# Altium schematic sheet Schematic_Muon.schdoc
size 1096 x 268 mm
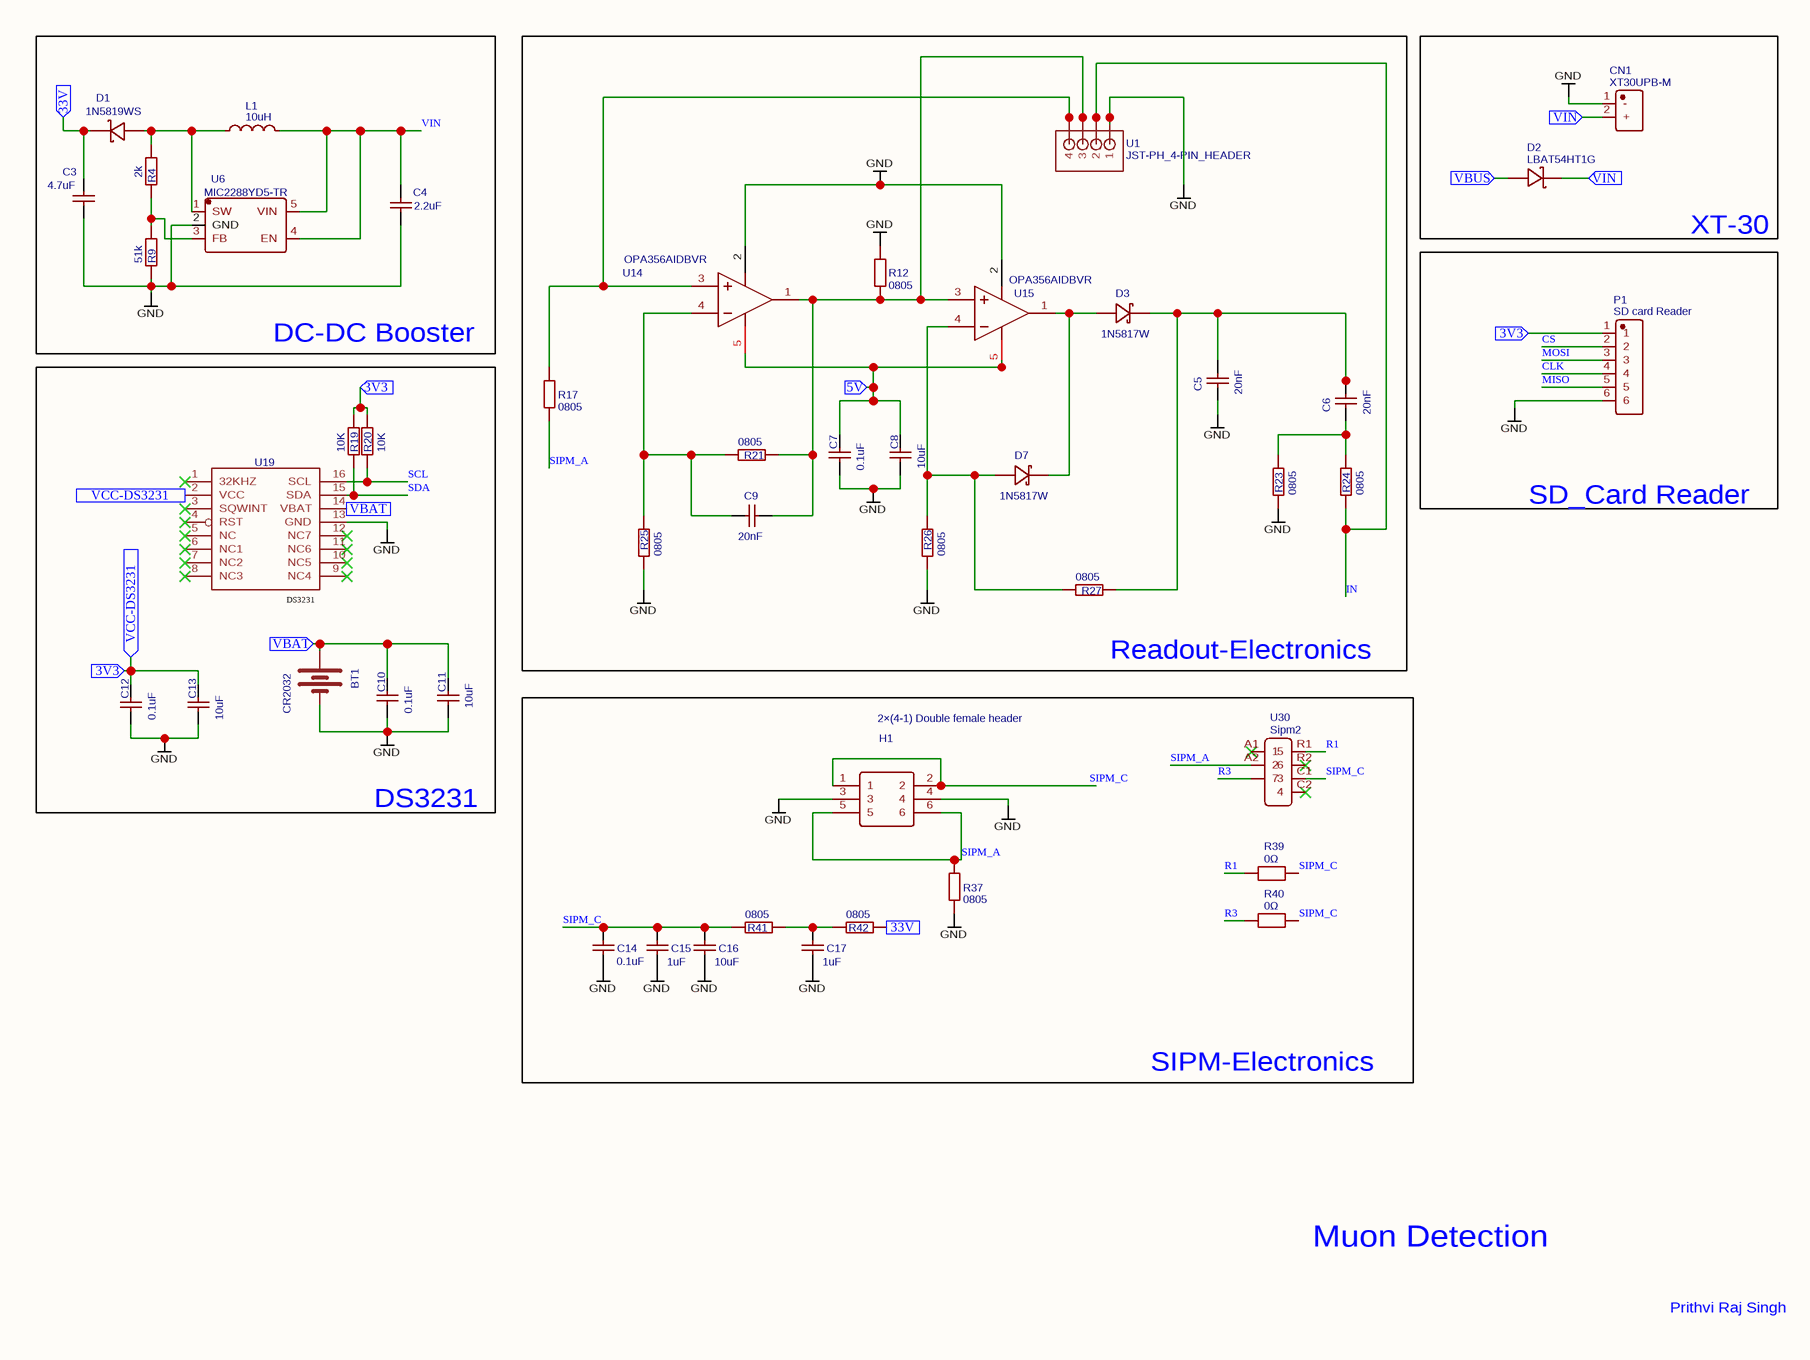
[diagram p0: Schematic_Muon.schdoc, column 1 of 4]
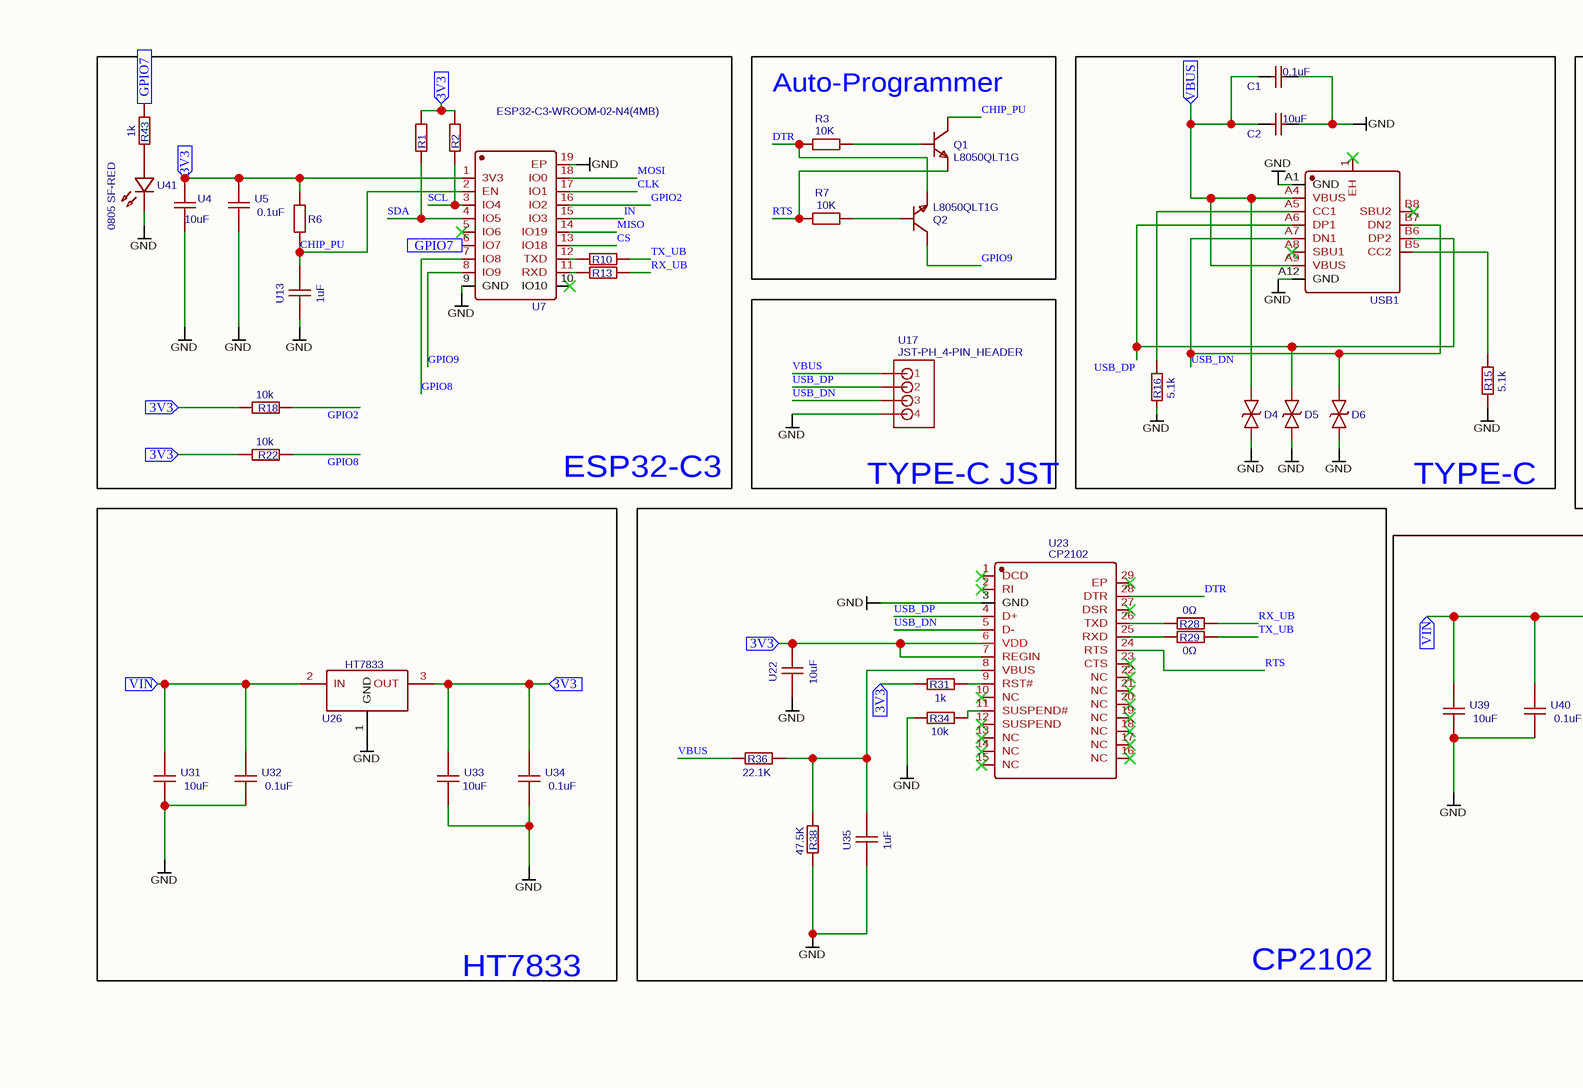
[diagram p1: Schematic_Muon.schdoc, column 2 of 4]
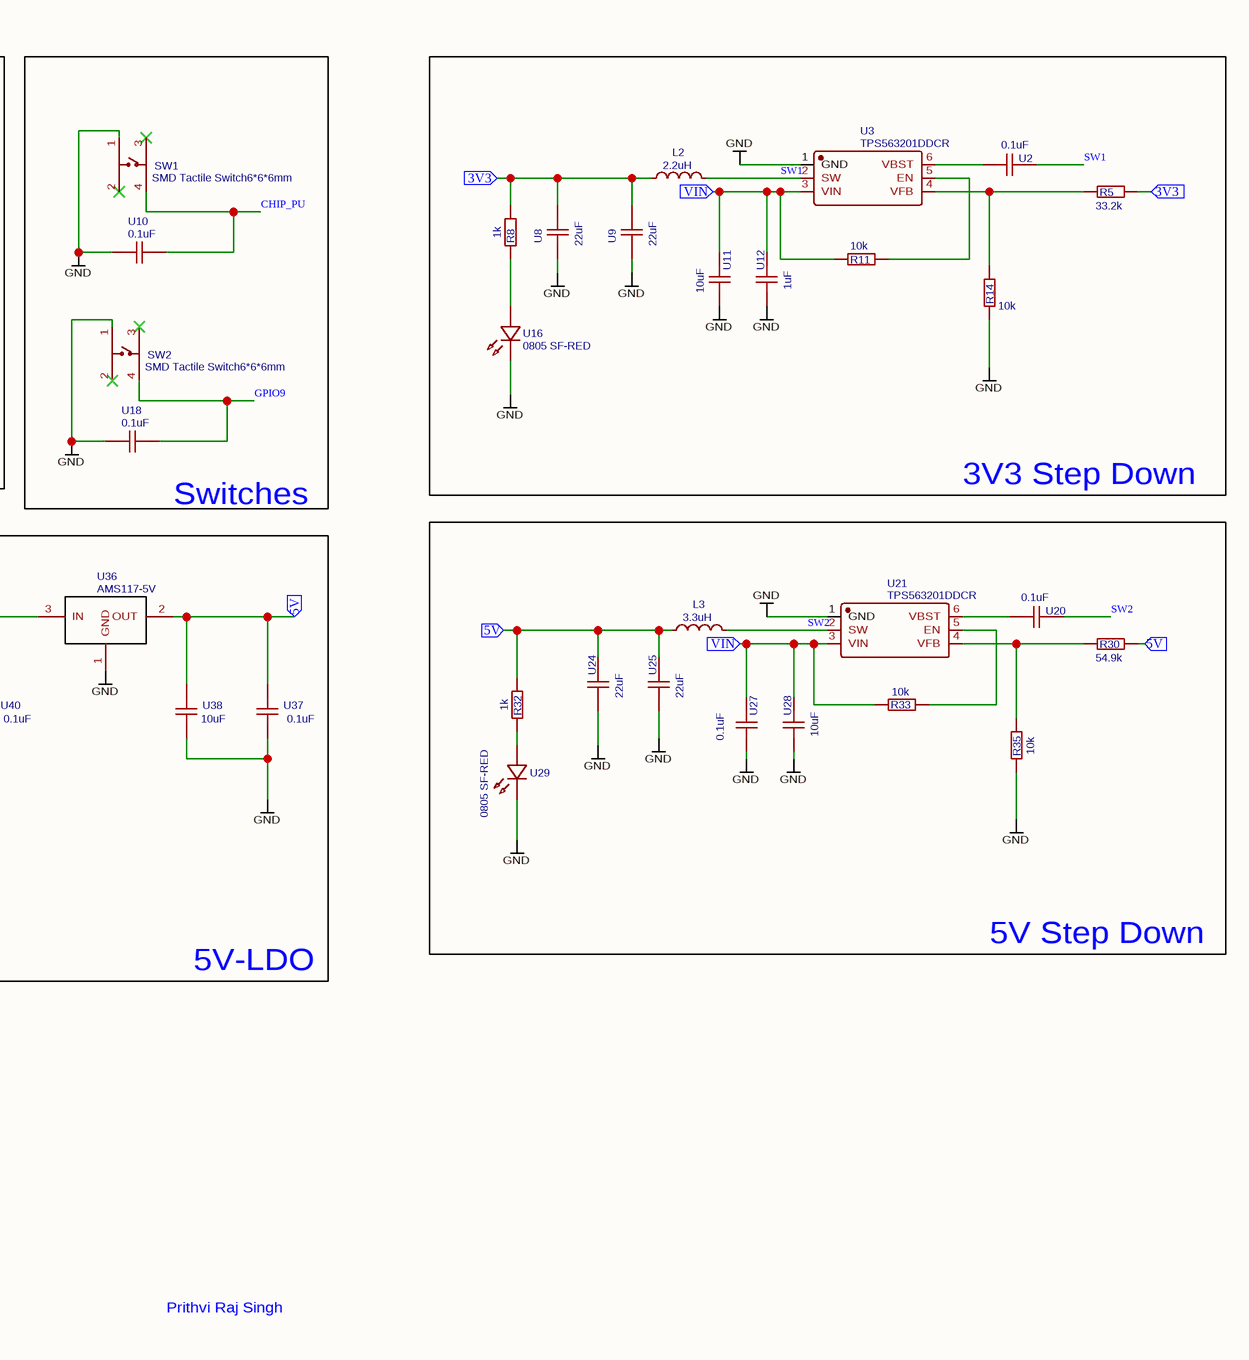
[diagram p2: Schematic_Muon.schdoc, column 3 of 4]
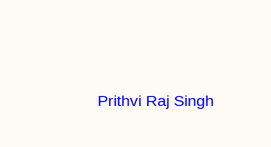
[diagram p3: Schematic_Muon.schdoc, column 4 of 4]

## Parts
BT1  CR2032  [BAT-SMD_CR2032]
C1  0.1uF  [C0805]
C2  10uF  [C0805]
C3  4.7uF  [C0805]
C4  2.2uF  [C0805]
C5  20nF  [C0805]
C6  20nF  [C0805]
C7  0.1uF  [C0805]
C8  10uF  [C0805]
C9  20nF  [C0805]
C10  0.1uF  [C0805]
C11  10uF  [C0805]
C12  0.1uF  [C0805]
C13  10uF  [C0805]
C14  0.1uF  [C0805]
C15  1uF  [C0805]
C16  10uF  [C0805]
C17  1uF  [C0805]
CN1  XT30UPB-M  [CONN-TH_XT30UPB-M]
D1  1N5819WS  [SOD-323_L1.8-W1.3-LS2.5-RD]
D2  LBAT54HT1G  [SOD-323_L1.8-W1.3-LS2.5-RD]
D3  1N5817W  [SOD-123_L2.8-W1.8-LS3.7-RD]
D4  SMBJ7.5CA-QH  [DO-214AA_L4.4-W3.6-LS5.3-BI]  (value not drawn)
D5  SMBJ7.5CA-QH  [DO-214AA_L4.4-W3.6-LS5.3-BI]  (value not drawn)
D6  SMBJ7.5CA-QH  [DO-214AA_L4.4-W3.6-LS5.3-BI]  (value not drawn)
D7  1N5817W  [SOD-123_L2.8-W1.8-LS3.7-RD]
H1  2×(4-1) Double female header  [HDR-TH_6P-P2.54-V-F-R2-C3-S2.54-1]
L1  10uH  [IND-SMD_L6.0-W6.0_FNR60XXS]
L2  2.2uH  [IND-SMD_L4.0-W4.0_SMNR4012]
L3  3.3uH  [IND-SMD_L4.0-W4.0_SMNR4012]
P1  SD card Reader  [HDR-TH_6P-P2.54-V-F]
Q1  L8050QLT1G  [SOT-23-3_L2.9-W1.3-P1.90-LS2.4-BR]
Q2  L8050QLT1G  [SOT-23-3_L2.9-W1.3-P1.90-LS2.4-BR]
R1  10k  [R0805]  (value not drawn)
R2  10k  [R0805]  (value not drawn)
R3  10K  [R0805]
R4  2k  [R0805]
R5  33.2k  [R0805]
R6  10K  [R0805]  (value not drawn)
R7  10K  [R0805]
R8  1k  [R0805]
R9  51k  [R0805]
R10  499  [R0805]  (value not drawn)
R11  10k  [R0805]
R12  0805  [R0805]
R13  499  [R0805]  (value not drawn)
R14  10k  [R0805]
R15  5.1k  [R0805]
R16  5.1k  [R0805]
R17  0805  [R0805]
R18  10k  [R0805]
R19  10K  [R0805]
R20  10K  [R0805]
R21  0805  [R0805]
R22  10k  [R0805]
R23  0805  [R0805]
R24  0805  [R0805]
R25  0805  [R0805]
R26  0805  [R0805]
R27  0805  [R0805]
R28  0Ω  [R0805]
R29  0Ω  [R0805]
R30  54.9k  [R0805]
R31  1k  [R0805]
R32  1k  [R0805]
R33  10k  [R0805]
R34  10k  [R0805]
R35  10k  [R0805]
R36  22.1K  [R0805]
R37  0805  [R0805]
R38  47.5K  [R0805]
R39  0Ω  [R0805]
R40  0Ω  [R0805]
R41  0805  [R0805]
R42  0805  [R0805]
R43  1k  [R0805]
SW1  SMD Tactile Switch6*6*6mm  [SW-SMD_4P-L6.0-W6.0-P4.50-LS9.0_C23873]
SW2  SMD Tactile Switch6*6*6mm  [SW-SMD_4P-L6.0-W6.0-P4.50-LS9.0_C23873]
U1  JST-PH_4-PIN_HEADER  [JST_B4B-PH_HEADER]
U2  0.1uF  [C0402]
U3  TPS563201DDCR  [SOT-23-6_L2.9-W1.6-P0.95-LS2.8-BR]
U4  10uF  [C0402]
U5  0.1uF  [C0402]
U6  MIC2288YD5-TR  [TSOT-23-5_L2.9-W1.6-P0.95-LS2.8-BR]
U7  ESP32-C3-WROOM-02-N4(4MB)  [BULETM-SMD_ESPRESSIF_ESP32-C3-WROOM-02-N4-4MB]
U8  22uF  [C0402]
U9  22uF  [C0402]
U10  0.1uF  [C0402]
U11  10uF  [C0402]
U12  1uF  [C0402]
U13  1uF  [C0402]
U14  OPA356AIDBVR  [SOT-23-5_L3.0-W1.7-P0.95-LS2.8-BR]
U15  OPA356AIDBVR  [SOT-23-5_L3.0-W1.7-P0.95-LS2.8-BR]
U16  0805 SF-RED  [LED0805-RD_RED]
U17  JST-PH_4-PIN_HEADER  [JST_B4B-PH_HEADER]
U18  0.1uF  [C0402]
U19  DS3231  [SO16W]  (value not drawn)
U20  0.1uF  [C0402]
U21  TPS563201DDCR  [SOT-23-6_L2.9-W1.6-P0.95-LS2.8-BR]
U22  10uF  [C0402]
U23  CP2102  [QFN-28_L5.0-W5.0-P0.50-TL-EP3.2]
U24  22uF  [C0402]
U25  22uF  [C0402]
U26  HT7833  [SOT-89_L4.5-W2.5-P1.50-LS4.2-BR]
U27  0.1uF  [C0402]
U28  10uF  [C0402]
U29  0805 SF-RED  [LED0805-RD_RED]
U30  Sipm2  [SIPM_REVERSE]
U31  10uF  [C0402]
U32  0.1uF  [C0402]
U33  10uF  [C0402]
U34  0.1uF  [C0402]
U35  1uF  [C0402]
U36  AMS117-5V  [AMS117-TOPL]
U37  0.1uF  [C0402]
U38  10uF  [C0402]
U39  10uF  [C0402]
U40  0.1uF  [C0402]
U41  0805 SF-RED  [LED0805-RD_RED]
USB1  HX TYPE-C 16P 3MD 5A  [TYPE-C-SMD_HX-TYPE-C-16P-3MD-5A]  (value not drawn)

## Blocks framed on the sheet
DC-DC Booster: C3 C4 D1 L1 R4 R9 U6
Readout-Electronics: C5-C9 D3 D7 R12 R17 R21 R23-R27 U1 U14 U15
XT-30: CN1 D2
ESP32-C3: R1 R2 R6 R10 R13 R18 R22 R43 U4 U5 U7 U13 U41
Auto-Programmer: Q1 Q2 R3 R7
3V3 Step Down: L2 R5 R8 R11 R14 U2 U3 U8 U9 U11 U12 U16
SD_Card Reader: P1
DS3231: BT1 C10-C13 R19 R20 U19
5V-LDO: U36-U40
5V Step Down: L3 R30 R32 R33 R35 U20 U21 U24 U25 U27-U29
SIPM-Electronics: C14-C17 H1 R37 R39-R42 U30

## Ports
3V3 (in), 5V (in), 33V (in), GPIO7 (in), VBAT (in), VBUS (in), VCC-DS3231 (in), VIN (in)

## Nets
GND: BT1.1(-) C1.2 C2.2 C3.2 C4.2 C5.2 C7.2 C8.2 C10.2 C11.2 C12.2 C13.2 C14.2 C15.2 C16.2 C17.2 CN1.1(-) D4.2 D5.2 D6.2 H1.3 H1.4 P1.6 R9.1 R12.2 R14.1 R15.2 R16.1 R23.1 R25.2 R26.2 R34.1 R35.1 R37.1 R38.2 SW1.1 SW2.1 U1.P1(1) U3.1(GND) U4.2 U5.2 U6.2(GND) U7.9(GND) U7.19(EP) U8.2 U9.2 U10.1 U11.2 U12.2 U13.2 U14.2(V-) U15.2(V-) U16.1(K) U17.P4(4) U18.1 U19.13(GND) U21.1(GND) U22.2 U23.3(GND) U24.2 U25.2 U26.1(GND) U27.2 U28.2 U29.1(K) U31.2 U32.2 U33.2 U34.2 U35.2 U36.1(GND) U37.2 U38.2 U39.2 U40.2 U41.1(K) USB1.A1(GND) USB1.A12(GND)
3V3: C12.1 C13.1 L2.1 P1.1 R1.2 R2.2 R5.1 R6.1 R8.2 R18.1 R19.1 R20.1 R22.1 R31.1 U4.1 U5.1 U7.1(3V3) U8.1 U9.1 U19.2(VCC) U22.1 U23.6(VDD) U23.7(REGIN) U26.3(OUT) U33.1 U34.1 ; port 3V3, port VCC-DS3231
5V: C7.1 C8.1 L3.1 R30.1 R32.2 U14.5(V+) U15.5(V+) U24.1 U25.1 U36.2(OUT) U37.1 U38.1 ; port 5V
33V: C3.1 D1.1(K) R42.2 ; port 33V
CHIP_PU: Q1.3(C) R6.2 SW1.4 U7.2(EN) U10.2 U13.1
CLK: P1.4 U7.17(IO1)
CS: P1.2 U7.13(IO18)
DTR: Q2.2(E) R3.1 U23.28(DTR)
GPIO2: R18.2 U7.16(IO2)
GPIO7: R43.2 U7.6(IO7) ; port GPIO7
GPIO8: R22.2 U7.7(IO8)
GPIO9: Q2.3(C) SW2.4 U7.8(IO9) U18.2
IN: R24.1 U1.P2(2) U7.15(IO3)
MISO: P1.5 U7.14(IO19)
MOSI: P1.3 U7.18(IO0)
R1: R39.1 U30.R1(5)
R3: R40.1 U30.?1(7)
RTS: Q1.2(E) R7.1 U23.24(RTS)
RX_UB: R13.2 R28.2
SCL: R2.1 R20.2 U7.3(IO4) U19.16(SCL)
SDA: R1.1 R19.2 U7.4(IO5) U19.15(SDA)
SIPM_A: H1.5 H1.6 R17.1 R37.2 U30.A2(2)
SIPM_C: C14.1 C15.1 C16.1 H1.1 H1.2 R39.2 R40.2 R41.1 U30.C1(3)
SW1: L2.2 U2.2 U3.2(SW)
SW2: L3.2 U20.2 U21.2(SW)
TX_UB: R10.2 R29.2
USB_DN: D6.1 U17.P3(3) U23.5(D-) USB1.A7(DN1) USB1.B7(DN2)
USB_DP: D5.1 U17.P2(2) U23.4(D+) USB1.A6(DP1) USB1.B6(DP2)
VBAT: BT1.2(+) C10.1 C11.1 U19.14(VBAT) ; port VBAT
VBUS: R36.1 U17.P1(1)
VBUS: C1.1 C2.1 D2.2(A) D4.1 USB1.A4(VBUS) USB1.A9(VBUS) ; port VBUS  [a separate net that carries the same name]
VIN: CN1.2(+) D2.1(K) R11.2 R33.2 U3.3(VIN) U11.1 U12.1 U21.3(VIN) U26.2(IN) U27.1 U28.1 U31.1 U32.1 U36.3(IN) U39.1 U40.1 ; port VIN
VIN: C4.1 L1.2 U6.4(EN) U6.5(VIN)  [a separate net that carries the same name]
NetC5_1: C5.1 C6.1 D3.1(C) R27.1
NetC6_2: C6.2 R23.2 R24.2
NetC9_1: C9.1 R21.1 R25.1 U14.4(IN-)
NetC9_2: C9.2 R12.1 R21.2 U1.P3(3) U14.1(OUT) U15.3(IN+)
NetC17_1: C17.1 R41.2 R42.1
NetD1_2: D1.2(A) L1.1 R4.2 U6.1(SW)
NetD3_2: D3.2(A) D7.1(C) U15.1(OUT)
NetD7_2: D7.2(A) R26.1 R27.2 U15.4(IN-)
NetQ1_1: Q1.1(B) R3.2
NetQ2_1: Q2.1(B) R7.2
NetR4_1: R4.1 R9.2 U6.3(FB)
NetR5_2: R5.2 R14.2 U3.4(VFB)
NetR8_1: R8.1 U16.2(A)
NetR10_1: R10.1 U7.12(TXD)
NetR11_1: R11.1 U3.5(EN)
NetR13_1: R13.1 U7.11(RXD)
NetR15_1: R15.1 USB1.B5(CC2)
NetR16_2: R16.2 USB1.A5(CC1)
NetR17_2: R17.2 U1.P4(4) U14.3(IN+)
NetR28_1: R28.1 U23.26(TXD)
NetR29_1: R29.1 U23.25(RXD)
NetR30_2: R30.2 R35.2 U21.4(VFB)
NetR31_2: R31.2 U23.9(RST#)
NetR32_1: R32.1 U29.2(A)
NetR33_1: R33.1 U21.5(EN)
NetR34_2: R34.2 U23.11(SUSPEND#)
NetR36_2: R36.2 R38.1 U23.8(VBUS) U35.1
NetR43_1: R43.1 U41.2(A)
NetU2_1: U2.1 U3.6(VBST)
NetU20_1: U20.1 U21.6(VBST)

Not connected (* = marked no-connect by the designer): SW1 2* 3*; SW2 2* 3*; U7 5(IO6)* 10(IO10)*; U19 1(32KHZ)* 3(SQWINT)* 4(RST)* 5(NC)* 6(NC1)* 7(NC2)* 8(NC3)* 9(NC4)* 10(NC5)* 11(NC6)* 12(NC7)*; U23 1(DCD)* 2(RI)* 10(NC)* 12(SUSPEND)* 13(NC)* 14(NC)* 15(NC)* 16(NC)* 17(NC)* 18(NC)* 19(NC)* 20(NC)* 21(NC)* 22(NC)* 23(CTS)* 27(DSR)* 29(EP)*; U30 A1(1)* C2(4)* R2(6)*; USB1 1(EH)* A8(SBU1)* B8(SBU2)*

## Notes on the sheet
- (near U17) TYPE-C JST
- TYPE-C
- (near U18) Switches
- HT7833
- CP2102
- Muon Detection
- Prithvi Raj Singh

## Library data of the parts
BT1 = CR2032: Manufacturer: null; Contributor: LCSC; Supplier: LCSC; Supplier Part: C9900001893; Manufacturer Part: CR2032; JLCPCB Part Class: Extended Part; spicePre: B; spiceSymbolName: CR2032_C9900001893
C1 C7 C10 C12 C14 = 0.1uF: Manufacturer: FH(风华); Manufacturer Part: 0805B203K500NT; nameAlias: Value; Supplier: LCSC; Supplier Part: C1726; JLCPCB Part Class: Extended Part; spicePre: C; spiceSymbolName: 0805B203K500NT
C2 C8 C11 C13 C16 = 10uF: Manufacturer: FH(风华); Manufacturer Part: 0805B203K500NT; nameAlias: Value; Supplier: LCSC; Supplier Part: C1726; JLCPCB Part Class: Extended Part; spicePre: C; spiceSymbolName: 0805B203K500NT
C3 = 4.7uF: Manufacturer: FH(风华); Manufacturer Part: 0805B203K500NT; nameAlias: Value; Supplier: LCSC; Supplier Part: C1726; JLCPCB Part Class: Extended Part; spicePre: C; spiceSymbolName: 0805B203K500NT
C4 = 2.2uF: Manufacturer: FH(风华); Manufacturer Part: 0805B203K500NT; nameAlias: Value; Supplier: LCSC; Supplier Part: C1726; JLCPCB Part Class: Extended Part; spicePre: C; spiceSymbolName: 0805B203K500NT
C5 C6 C9 = 20nF: Manufacturer: FH(风华); Manufacturer Part: 0805B203K500NT; nameAlias: Value; Supplier: LCSC; Supplier Part: C1726; JLCPCB Part Class: Extended Part; spicePre: C; spiceSymbolName: 0805B203K500NT
C15 C17 = 1uF: Manufacturer: FH(风华); Manufacturer Part: 0805B203K500NT; nameAlias: Value; Supplier: LCSC; Supplier Part: C1726; JLCPCB Part Class: Extended Part; spicePre: C; spiceSymbolName: 0805B203K500NT
CN1 = XT30UPB-M: Manufacturer: AMASS(艾迈斯); Contributor: LCSC; Supplier: LCSC; Supplier Part: C428721; Manufacturer Part: XT30UPB-M; JLCPCB Part Class: Extended Part; spicePre: C; spiceSymbolName: XT30UPB-M
D1 = 1N5819WS: Manufacturer: Hottech(合科泰); Contributor: LCSC; Supplier: LCSC; Supplier Part: C191023; Manufacturer Part: 1N5819WS; JLCPCB Part Class: Basic Part; spicePre: D; spiceSymbolName: 1N5819WS
D2 = LBAT54HT1G: Manufacturer: LRC(乐山无线电); Supplier: LCSC; Manufacturer Part: LBAT54HT1G; Supplier Part: C12744; JLCPCB Part Class: Extended Part; spicePre: D; spiceSymbolName: LBAT54HT1G
D3 D7 = 1N5817W: Manufacturer: TWGMC(台湾迪嘉); Contributor: LCSC; Supplier: LCSC; Supplier Part: C727113; Manufacturer Part: 1N5817W; JLCPCB Part Class: Extended Part; spicePre: D; spiceSymbolName: 1N5817W
D4-D6 = SMBJ7.5CA-QH: Manufacturer: BOURNS; Contributor: lcsc; Supplier: LCSC; Supplier Part: C1518389; Manufacturer Part: SMBJ7.5CA-QH; JLCPCB Part Class: Extended Part; spicePre: D; spiceSymbolName: SMBJ7.5CA-QH
H1 = 2×(4-1) Double female header: Manufacturer: BOOMELE; Supplier: LCSC; Manufacturer Part: 2×(4-1) Double female header; Supplier Part: C60376; JLCPCB Part Class: Extended Part; spicePre: H; spiceSymbolName: 2×(4-1) Double female header
L1 = 10uH: Manufacturer: Sunlord(顺络); Manufacturer Part: SWPA6028S100MT; nameAlias: Value; Supplier: LCSC; Supplier Part: C65664; JLCPCB Part Class: Extended Part; spicePre: L; spiceSymbolName: SWPA6028S100MT
L2 = 2.2uH: Manufacturer: Sunlord(顺络); Manufacturer Part: SWPA4030S3R3MT; nameAlias: Value; Supplier: LCSC; Supplier Part: C15269; JLCPCB Part Class: Extended Part; spicePre: L; spiceSymbolName: SWPA4030S3R3MT
L3 = 3.3uH: Manufacturer: Sunlord(顺络); Manufacturer Part: SWPA4030S3R3MT; nameAlias: Value; Supplier: LCSC; Supplier Part: C15269; JLCPCB Part Class: Extended Part; spicePre: L; spiceSymbolName: SWPA4030S3R3MT
P1 = SD card Reader: Manufacturer: BOOMELE(博穆精密); Manufacturer Part: 2.54-1*6P母; Supplier: LCSC; Supplier Part: C40877; JLCPCB Part Class: Extended Part; spicePre: P; spiceSymbolName: Header-Female-2.54_1x6
Q1 Q2 = L8050QLT1G: Manufacturer: LRC(乐山无线电); Supplier: LCSC; Manufacturer Part: L8050QLT1G; Supplier Part: C49581; JLCPCB Part Class: Extended Part; spicePre: Q; spiceSymbolName: L8050QLT1G
R1 R2 R11 R14 R18 R22 R33-R35 = 10k: Manufacturer: null; Manufacturer Part: 0805; Contributor: LCSC; Supplier: LCSC; Supplier Part: C9900012714; JLCPCB Part Class: Extended Part; spicePre: R; spiceSymbolName: 0805_C9900012714
R3 R6 R7 R19 R20 = 10K: Manufacturer: null; Manufacturer Part: 0805; Contributor: LCSC; Supplier: LCSC; JLCPCB Part Class: Extended Part; spicePre: R
  R3 R6 R7: Supplier Part: C9900012714; spiceSymbolName: 0805_C9900012714
  R19 R20: Supplier Part: C9900012715; spiceSymbolName: 0805
R4 = 2k: Manufacturer: null; Manufacturer Part: 0805; Contributor: LCSC; Supplier: LCSC; Supplier Part: C9900012715; JLCPCB Part Class: Extended Part; spicePre: R; spiceSymbolName: 0805
R5 = 33.2k: Manufacturer: null; Manufacturer Part: 0805; Contributor: LCSC; Supplier: LCSC; Supplier Part: C9900012714; JLCPCB Part Class: Extended Part; spicePre: R; spiceSymbolName: 0805_C9900012714
R8 R31 R32 R43 = 1k: Manufacturer: null; Manufacturer Part: 0805; Contributor: LCSC; Supplier: LCSC; Supplier Part: C9900012714; JLCPCB Part Class: Extended Part; spicePre: R; spiceSymbolName: 0805_C9900012714
R9 = 51k: Manufacturer: null; Manufacturer Part: 0805; Contributor: LCSC; Supplier: LCSC; Supplier Part: C9900012715; JLCPCB Part Class: Extended Part; spicePre: R; spiceSymbolName: 0805
R10 R13 = 499: Manufacturer: null; Manufacturer Part: 0805; Contributor: LCSC; Supplier: LCSC; Supplier Part: C9900012714; JLCPCB Part Class: Extended Part; spicePre: R; spiceSymbolName: 0805_C9900012714
R12 R17 R21 R23-R27 R37 R41 R42 = 0805: Manufacturer: null; Contributor: LCSC; Supplier: LCSC; Supplier Part: C9900012715; Manufacturer Part: 0805; JLCPCB Part Class: Extended Part; spicePre: R; spiceSymbolName: 0805
R15 R16 = 5.1k: Manufacturer: null; Manufacturer Part: 0805; Contributor: LCSC; Supplier: LCSC; Supplier Part: C9900012714; JLCPCB Part Class: Extended Part; spicePre: R; spiceSymbolName: 0805_C9900012714
R28 R29 = 0Ω: Manufacturer: null; Manufacturer Part: 0805; Contributor: LCSC; Supplier: LCSC; Supplier Part: C9900012714; JLCPCB Part Class: Extended Part; spicePre: R; spiceSymbolName: 0805_C9900012714
R30 = 54.9k: Manufacturer: null; Manufacturer Part: 0805; Contributor: LCSC; Supplier: LCSC; Supplier Part: C9900012714; JLCPCB Part Class: Extended Part; spicePre: R; spiceSymbolName: 0805_C9900012714
R36 = 22.1K: Manufacturer: null; Manufacturer Part: 0805; Contributor: LCSC; Supplier: LCSC; Supplier Part: C9900012714; JLCPCB Part Class: Extended Part; spicePre: R; spiceSymbolName: 0805_C9900012714
R38 = 47.5K: Manufacturer: null; Manufacturer Part: 0805; Contributor: LCSC; Supplier: LCSC; Supplier Part: C9900012714; JLCPCB Part Class: Extended Part; spicePre: R; spiceSymbolName: 0805_C9900012714
R39 R40 = 0Ω: Manufacturer: FOJAN(富捷); Manufacturer Part: FRC0805P000 TS; Contributor: lcsc; nameAlias: Value; Supplier: LCSC; Supplier Part: C2907288; JLCPCB Part Class: Extended Part; spicePre: R; spiceSymbolName: FRC0805P000 TS
SW1 SW2 = SMD Tactile Switch6*6*6mm: Manufacturer: null; Manufacturer Part: 贴片轻触开关6*6*6mm; Supplier Part: C23873; Supplier: LCSC; JLCPCB Part Class: Extended Part; spicePre: S; spiceSymbolName: SMD Tactile Switch6*6*6mm
U2 U5 U10 U18 U20 U27 U32 U34 U37 U40 = 0.1uF: Manufacturer: null; Manufacturer Part: GRM155R71E103KA01D  SMD Ceramic Capacitor; Contributor: lcsc; Supplier: LCSC; Supplier Part: C29020409; spicePre: U; spiceSymbolName: GRM155R71E103KA01D  SMD CERAMIC CAPACITOR
U3 U21 = TPS563201DDCR: Manufacturer: TI(德州仪器); Contributor: LCSC; Supplier: LCSC; Supplier Part: C116592; Manufacturer Part: TPS563201DDCR; JLCPCB Part Class: Extended Part; spicePre: U; spiceSymbolName: TPS563201DDCR
U4 U11 U22 U28 U31 U33 U38 U39 = 10uF: Manufacturer: null; Manufacturer Part: GRM155R71E103KA01D  SMD Ceramic Capacitor; Contributor: lcsc; Supplier: LCSC; Supplier Part: C29020409; spicePre: U; spiceSymbolName: GRM155R71E103KA01D  SMD CERAMIC CAPACITOR
U6 = MIC2288YD5-TR: Manufacturer: MICROCHIP(美国微芯); Contributor: LCSC; Supplier: LCSC; Supplier Part: C220754; Manufacturer Part: MIC2288YD5-TR; JLCPCB Part Class: Extended Part; spicePre: U; spiceSymbolName: MIC2288YD5-TR
U7 = ESP32-C3-WROOM-02-N4(4MB): Manufacturer: ESPRESSIF(乐鑫); Contributor: LCSC; Supplier: LCSC; Supplier Part: C2934560; Manufacturer Part: ESP32-C3-WROOM-02-N4; spicePre: U; spiceSymbolName: ESP32-C3-WROOM-02-N4(4MB)
U8 U9 U24 U25 = 22uF: Manufacturer: null; Manufacturer Part: GRM155R71E103KA01D  SMD Ceramic Capacitor; Contributor: lcsc; Supplier: LCSC; Supplier Part: C29020409; spicePre: U; spiceSymbolName: GRM155R71E103KA01D  SMD CERAMIC CAPACITOR
U12 U13 U35 = 1uF: Manufacturer: null; Manufacturer Part: GRM155R71E103KA01D  SMD Ceramic Capacitor; Contributor: lcsc; Supplier: LCSC; Supplier Part: C29020409; spicePre: U; spiceSymbolName: GRM155R71E103KA01D  SMD CERAMIC CAPACITOR
U14 U15 = OPA356AIDBVR: Manufacturer: TI(德州仪器); Contributor: LCSC; Supplier: LCSC; Supplier Part: C183100; Manufacturer Part: OPA356AIDBVR; JLCPCB Part Class: Extended Part; spicePre: U; spiceSymbolName: OPA356AIDBVR
U16 U29 U41 = 0805 SF-RED: Manufacturer: null; Contributor: lcsc; Supplier: LCSC; Supplier Part: C9900020303; Manufacturer Part: 0805 SF-Red; JLCPCB Part Class: Extended Part; spicePre: U; spiceSymbolName: 0805 SF-RED
U19 = DS3231: Contributor: Adafruit; spicePre: U; spiceSymbolName: DS3231
U23 = CP2102: Manufacturer: null; Contributor: LCSC; Supplier: LCSC; Supplier Part: C9900004371; Manufacturer Part: CP2102; JLCPCB Part Class: Extended Part; spicePre: U; spiceSymbolName: CP2102
U26 = HT7833: Manufacturer: HOLTEK(合泰/盛群); Supplier: LCSC; Manufacturer Part: HT7833; Supplier Part: C50936; JLCPCB Part Class: Extended Part; spicePre: U; spiceSymbolName: HT7833
U30 = Sipm2: Contributor: bala08052005; spicePre: U; spiceSymbolName: Sipm2
U36 = AMS117-5V: Contributor: Achmad Purnomo; spicePre: U; spiceSymbolName: AMS117
USB1 = HX TYPE-C 16P 3MD 5A: Manufacturer: hanxia(韩下); Contributor: lcsc; Supplier: LCSC; Supplier Part: C5178540; Manufacturer Part: HX TYPE-C 16P 3MD 5A; JLCPCB Part Class: Extended Part; spicePre: U; spiceSymbolName: HX TYPE-C 16P 3MD 5A
U1 U17 = JST-PH_4-PIN_HEADER: spicePre: U; spiceSymbolName: JST-PH_4-PIN_HEADER